# EAGLE schematic DIN49073-example-1 (EAGLE 6.5.0)
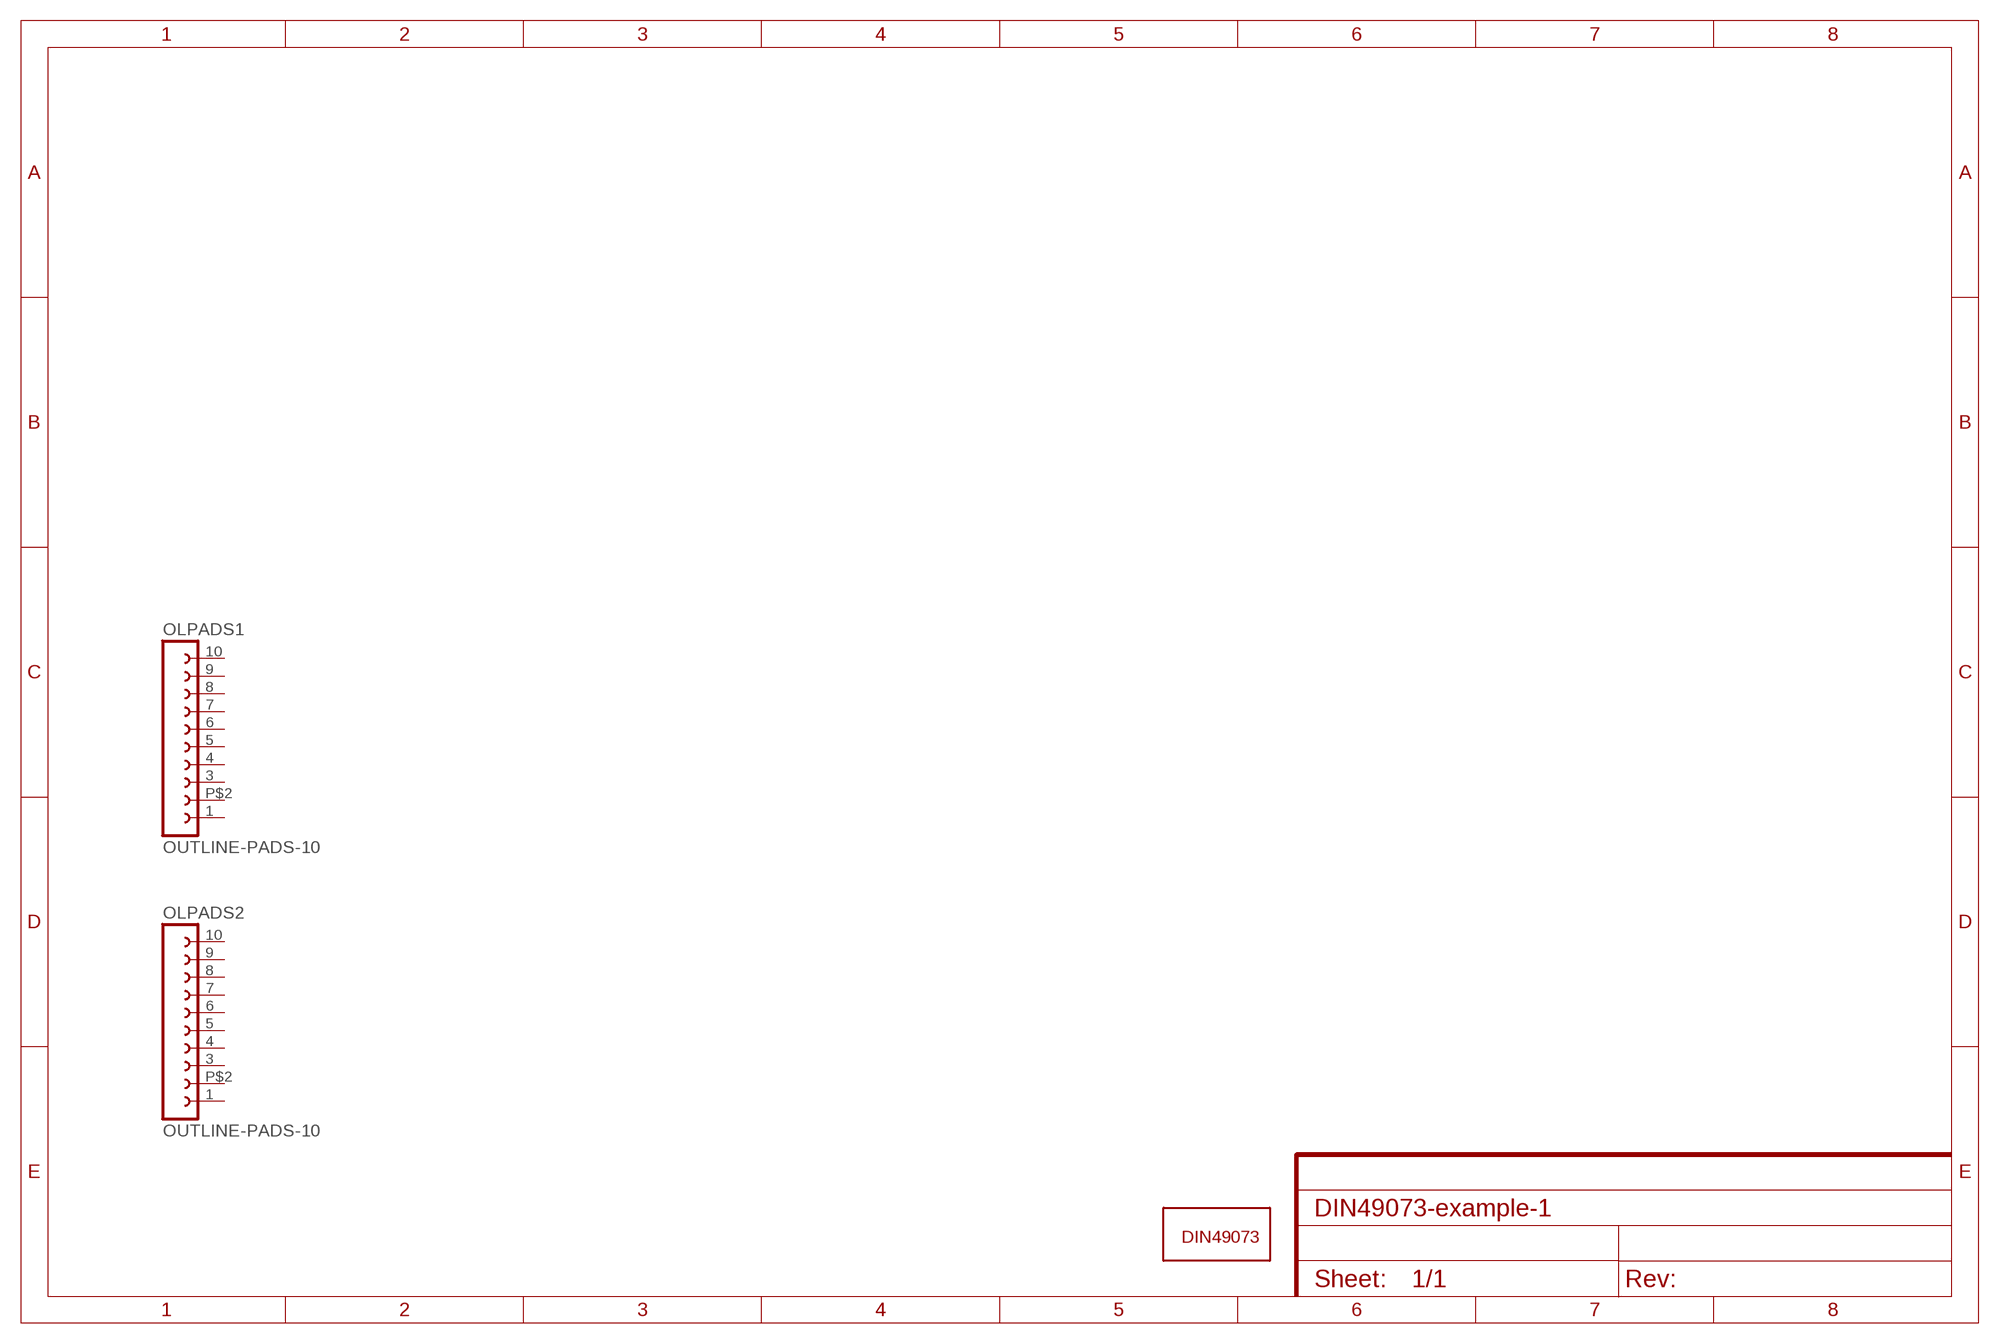
[diagram p0: schematic, sheet 1]

## Parts
DIMENSIONS1  DIN49073-OUTLINE  [DIN49073-1:2010-02-OUTLINE]
OLPADS1  OUTLINE-PADS-10  [DIN49073-1:2010-02-PADS-10]
OLPADS2  OUTLINE-PADS-10  [DIN49073-1:2010-02-PADS-10]
Unconnected: OLPADS1.1 OLPADS1.3 OLPADS1.4 OLPADS1.5 OLPADS1.6 OLPADS1.7 OLPADS1.8 OLPADS1.9 OLPADS1.10 OLPADS1.P$2 OLPADS2.1 OLPADS2.3 OLPADS2.4 OLPADS2.5 OLPADS2.6 OLPADS2.7 OLPADS2.8 OLPADS2.9 OLPADS2.10 OLPADS2.P$2

## Library data of the parts
DIMENSIONS1 = ELL-i-Boards:DIN49073: DIN49073 board Used to document in the schematic that the board outline is comliant with the DN49073 standard, and to select an appropriate dimension for the actual board.
OLPADS1 OLPADS2 = ELL-i-Boards:OUTLINE-PADS-10